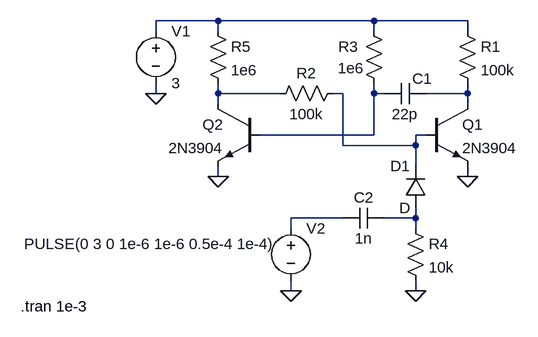
[diagram p0: schematic bjt_monostable.asc]
bjt_monostable.asc, the LTspice schematic file:
Version 4
SHEET 1 880 680
WIRE -128 -16 -224 -16
WIRE 112 -16 -128 -16
WIRE 256 -16 112 -16
WIRE -224 0 -224 -16
WIRE -128 0 -128 -16
WIRE 112 0 112 -16
WIRE 256 0 256 -16
WIRE -224 96 -224 80
WIRE -128 96 -128 80
WIRE -32 96 -128 96
WIRE 64 96 48 96
WIRE 112 96 112 80
WIRE 128 96 112 96
WIRE 256 96 256 80
WIRE 256 96 192 96
WIRE -128 112 -128 96
WIRE 256 112 256 96
WIRE 112 160 112 96
WIRE 112 160 -64 160
WIRE 192 160 176 160
WIRE 64 176 64 96
WIRE 176 176 176 160
WIRE 176 176 64 176
WIRE 176 208 176 176
WIRE -128 224 -128 208
WIRE 256 224 256 208
WIRE 64 288 -16 288
WIRE 176 288 176 272
WIRE 176 288 128 288
WIRE -16 304 -16 288
WIRE 176 304 176 288
WIRE -16 400 -16 384
WIRE 176 400 176 384
FLAG 176 400 0
FLAG -224 96 0
FLAG -16 400 0
FLAG -128 224 0
FLAG 256 224 0
SYMBOL npn 192 112 R0
SYMATTR InstName Q1
SYMATTR Value 2N3904
SYMBOL npn -64 112 M0
SYMATTR InstName Q2
SYMATTR Value 2N3904
SYMBOL diode 192 272 R180
WINDOW 0 24 64 Left 2
WINDOW 3 24 0 Left 2
SYMATTR InstName D1
SYMBOL voltage -224 -16 R0
WINDOW 123 0 0 Left 2
WINDOW 39 0 0 Left 2
SYMATTR InstName V1
SYMATTR Value 3
SYMBOL res 240 -16 R0
SYMATTR InstName R1
SYMATTR Value 100k
SYMBOL res 64 80 R90
WINDOW 0 0 56 VBottom 2
WINDOW 3 32 56 VTop 2
SYMATTR InstName R2
SYMATTR Value 100k
SYMBOL res 96 -16 R0
WINDOW 0 -39 40 Left 2
WINDOW 3 -40 73 Left 2
SYMATTR InstName R3
SYMATTR Value 1e6
SYMBOL cap 192 80 R90
WINDOW 0 9 6 VBottom 2
WINDOW 3 32 32 VTop 2
SYMATTR InstName C1
SYMATTR Value 22p
SYMBOL res 160 288 R0
SYMATTR InstName R4
SYMATTR Value 10k
SYMBOL cap 128 272 R90
WINDOW 0 0 32 VBottom 2
WINDOW 3 32 32 VTop 2
SYMATTR InstName C2
SYMATTR Value 1n
SYMBOL voltage -16 288 R0
WINDOW 3 -411 40 Left 2
WINDOW 123 0 0 Left 2
WINDOW 39 0 0 Left 2
SYMATTR Value PULSE(0 3 0 1e-6 1e-6 0.5e-4 1e-4)
SYMATTR InstName V2
SYMBOL res -144 -16 R0
SYMATTR InstName R5
SYMATTR Value 1e6
TEXT -432 424 Left 2 !.tran 1e-3

The netlist it stands for:
* bjt_monostable.asc
Q1 N005 N003 0 0 2N3904
Q2 N002 N004 0 0 2N3904
D1 N007 N003 D
V1 N001 0 3
R1 N001 N005 100k
R2 N003 N002 100k
R3 N001 N004 1e6
C1 N005 N004 22p
R4 N007 0 10k
C2 N007 N006 1n
V2 N006 0 PULSE(0 3 0 1e-6 1e-6 0.5e-4 1e-4)
R5 N001 N002 1e6
.model D D
.lib standard.dio
.model NPN NPN
.model PNP PNP
.lib standard.bjt
.tran 1e-3
.backanno
.end